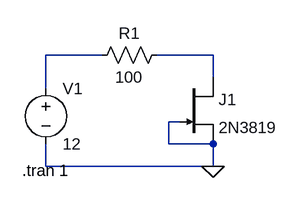
[diagram p0: schematic ConstantCurrent.asc]
ConstantCurrent.asc, the LTspice schematic file:
Version 4
SHEET 1 880 680
WIRE 144 80 64 80
WIRE 304 80 224 80
WIRE 304 112 304 80
WIRE 64 128 64 80
WIRE 256 176 240 176
WIRE 240 208 240 176
WIRE 304 208 240 208
WIRE 64 240 64 208
WIRE 304 240 304 208
WIRE 304 240 64 240
FLAG 304 240 0
SYMBOL voltage 64 112 R0
WINDOW 123 0 0 Left 0
WINDOW 39 0 0 Left 0
SYMATTR InstName V1
SYMATTR Value 12
SYMBOL njf 256 112 R0
SYMATTR InstName J1
SYMATTR Value 2N3819
SYMBOL res 240 64 R90
WINDOW 0 0 56 VBottom 2
WINDOW 3 32 56 VTop 2
SYMATTR InstName R1
SYMATTR Value 100
TEXT 30 246 Left 2 !.tran 1

The netlist it stands for:
* ConstantCurrent.asc
V1 N001 0 12
J1 N002 0 0 2N3819
R1 N002 N001 100
.model NJF NJF
.model PJF PJF
.lib standard.jft
.tran 1
.backanno
.end